# Altium schematic sheet sokolov_control_board_3.SchDoc: =title_line_1 + title_line_2
size 594 x 420 mm; SheetNumber: 3
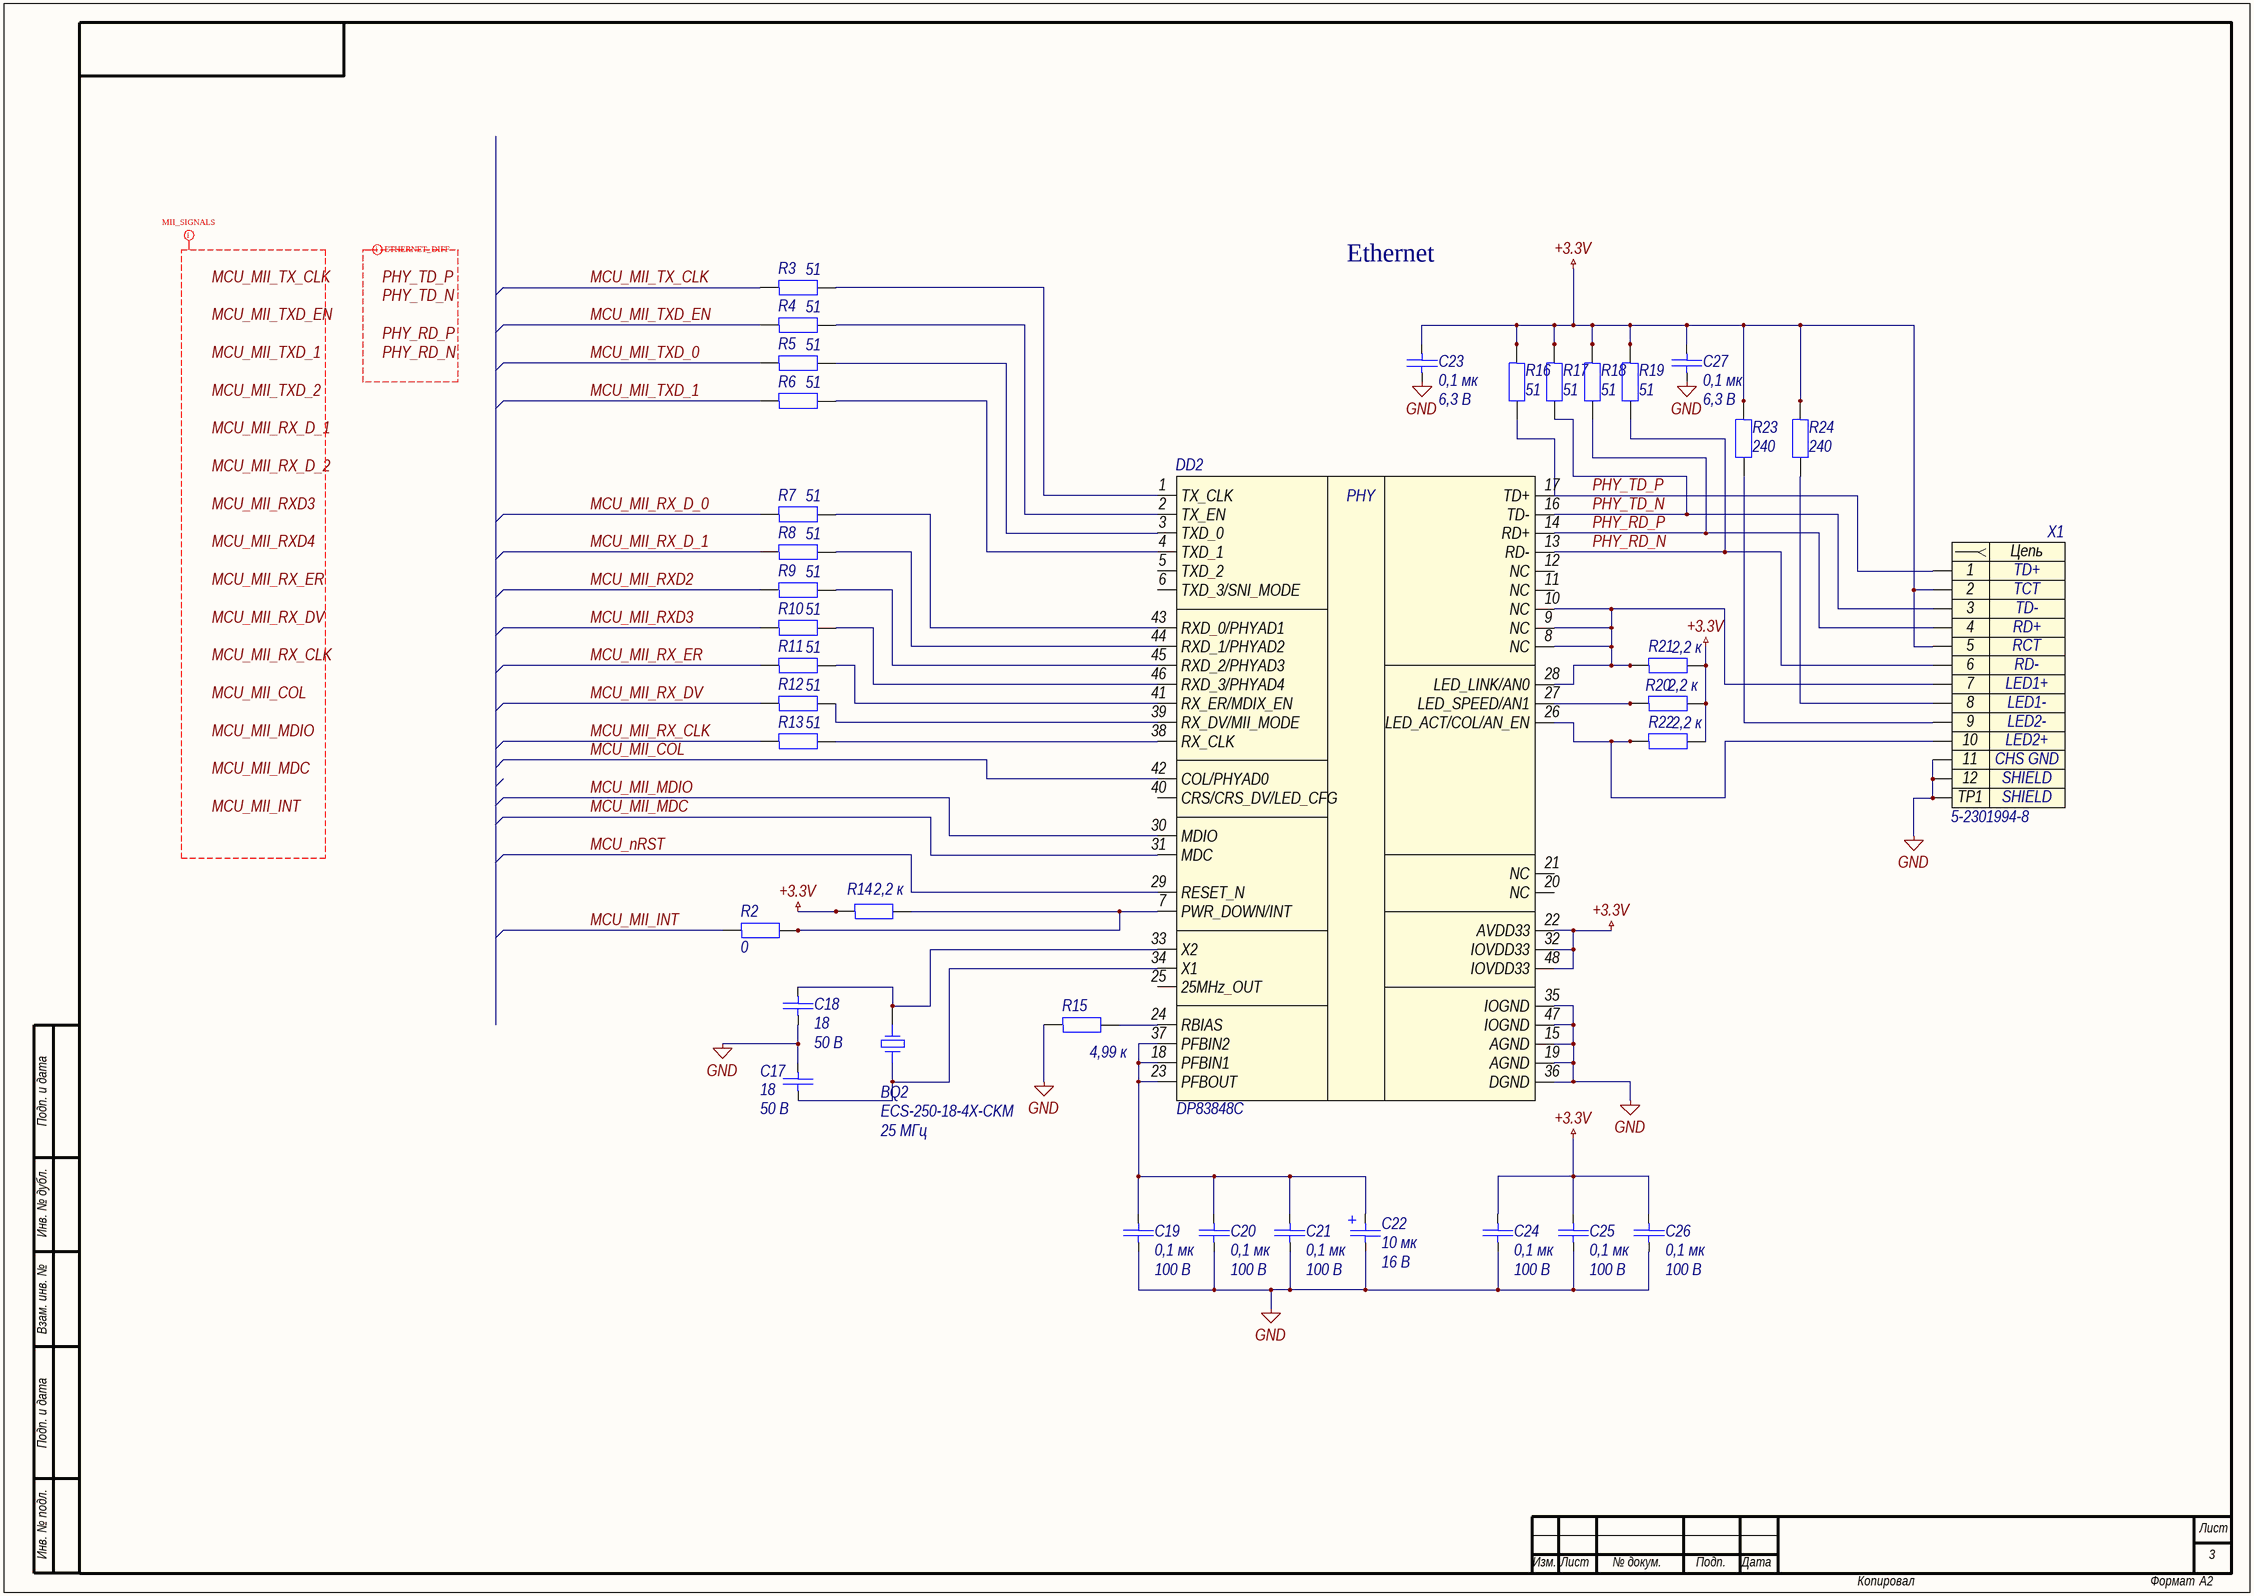
[diagram p0: sokolov_control_board_3.SchDoc]

## Parts
BQ2  ECS-250-18-4X-CKM  Частотa: 25 МГц  [HC-49/US]
C17  18  Напряжение: 50 В  [C0603]
C18  18  Напряжение: 50 В  [C0603]
C19  0,1 мк  Напряжение: 100 В  [C0603]
C20  0,1 мк  Напряжение: 100 В  [C0603]
C21  0,1 мк  Напряжение: 100 В  [C0603]
C22  10 мк  Напряжение: 16 В  [C3216-18]
C23  0,1 мк  Напряжение: 6,3 В  [C0402]
C24  0,1 мк  Напряжение: 100 В  [C0603]
C25  0,1 мк  Напряжение: 100 В  [C0603]
C26  0,1 мк  Напряжение: 100 В  [C0603]
C27  0,1 мк  Напряжение: 6,3 В  [C0402]
DD2  DP83848C  [LQFP-48-P50-700X700X160-L60X22]
R2  0  [R0603]
R3  51  [R0603]
R4  51  [R0603]
R5  51  [R0603]
R6  51  [R0603]
R7  51  [R0603]
R8  51  [R0603]
R9  51  [R0603]
R10  51  [R0603]
R11  51  [R0603]
R12  51  [R0603]
R13  51  [R0603]
R14  2,2 к  [R0603]
R15  4,99 к  [R0603]
R16  51  [R0603]
R17  51  [R0603]
R18  51  [R0603]
R19  51  [R0603]
R20  2,2 к  [R0603]
R21  2,2 к  [R0603]
R22  2,2 к  [R0603]
R23  240  [R0603]
R24  240  [R0603]
X1  5-2301994-8  [5-2301994-8]

## Nets
+3.3V: C23.2 C24.2 C25.2 C26.2 C27.2 DD2.22(AVDD33) DD2.32(IOVDD33) DD2.48(IOVDD33) R14.1 R16.1 R17.1 R18.1 R19.1 R20.2 R21.2 R22.2 R23.1 R24.1 X1.2 X1.5
GND: C17.2 C18.1 C19.1 C20.1 C21.1 C22.2 C23.1 C24.1 C25.1 C26.1 C27.1 DD2.15(AGND) DD2.19(AGND) DD2.35(IOGND) DD2.36(DGND) DD2.47(IOGND) R15.1 X1.11 X1.12 X1.TP1
MCU_MII_COL: DD2.42(COL/PHYAD0)
MCU_MII_INT: R2.1
MCU_MII_MDC: DD2.31(MDC)
MCU_MII_MDIO: DD2.30(MDIO)
MCU_MII_RX_CLK: R13.1
MCU_MII_RX_D_0: R7.1
MCU_MII_RX_D_1: R8.1
MCU_MII_RX_DV: R12.1
MCU_MII_RX_ER: R11.1
MCU_MII_RXD2: R9.1
MCU_MII_RXD3: R10.1
MCU_MII_TX_CLK: R3.1
MCU_MII_TXD_0: R5.1
MCU_MII_TXD_1: R6.1
MCU_MII_TXD_EN: R4.1
MCU_nRST: DD2.29(RESET_N)
PHY_RD_N: DD2.13(RD-) R19.2 X1.6
PHY_RD_P: DD2.14(RD+) R18.2 X1.4
PHY_TD_N: DD2.16(TD-) R17.2 X1.3
PHY_TD_P: DD2.17(TD+) R16.2 X1.1
NetBQ2_1: BQ2.1 C17.1 DD2.34(X1)
NetBQ2_2: BQ2.2 C18.2 DD2.33(X2)
NetC19_2: C19.2 C20.2 C21.2 C22.1 DD2.18(PFBIN1) DD2.23(PFBOUT) DD2.37(PFBIN2)
NetDD2_1: DD2.1(TX_CLK) R3.2
NetDD2_2: DD2.2(TX_EN) R4.2
NetDD2_3: DD2.3(TXD_0) R5.2
NetDD2_4: DD2.4(TXD_1) R6.2
NetDD2_7: DD2.7(PWR_DOWN/INT) R2.2 R14.2
NetDD2_8: DD2.8(NC) DD2.9(NC) DD2.10(NC) DD2.28(LED_LINK/AN0) R21.1 X1.7
NetDD2_24: DD2.24(RBIAS) R15.2
NetDD2_26: DD2.26(LED_ACT/COL/AN_EN) R22.1 X1.10
NetDD2_27: DD2.27(LED_SPEED/AN1) R20.1
NetDD2_38: DD2.38(RX_CLK) R13.2
NetDD2_39: DD2.39(RX_DV/MII_MODE) R12.2
NetDD2_41: DD2.41(RX_ER/MDIX_EN) R11.2
NetDD2_43: DD2.43(RXD_0/PHYAD1) R7.2
NetDD2_44: DD2.44(RXD_1/PHYAD2) R8.2
NetDD2_45: DD2.45(RXD_2/PHYAD3) R9.2
NetDD2_46: DD2.46(RXD_3/PHYAD4) R10.2
NetR23_2: R23.2 X1.9
NetR24_2: R24.2 X1.8

Not connected (* = marked no-connect by the designer): DD2 5(TXD_2) 6(TXD_3/SNI_MODE) 11(NC) 12(NC) 20(NC) 21(NC) 25(25MHz_OUT) 40(CRS/CRS_DV/LED_CFG)

## Layout directives
rule Width Constraint [Pref Impedance = 50,00ohms    Min Impedance = 50,00ohms    Max Impedance = 50,00ohms]; net class MII_CLASS: MCU_MII_COL, MCU_MII_INT, MCU_MII_MDC, MCU_MII_MDIO, MCU_MII_RX_CLK, MCU_MII_RX_D_1, MCU_MII_RX_D_2, MCU_MII_RX_DV, MCU_MII_RX_ER, MCU_MII_RXD3, MCU_MII_RXD4, MCU_MII_TX_CLK, MCU_MII_TXD_1, MCU_MII_TXD_2, MCU_MII_TXD_EN
differential pair; rule Differential Pairs Routing [Pref Gap = 0.254mm    Min Gap  = 0.15mm    Max Gap  = 0.254mmPref Width = 0.381mm    Min Width  = 0.155mm    Max Width  = 0.381mm]; differential pair class ETHERNET_DIFF_CLASS: PHY_RD_N, PHY_RD_P, PHY_TD_N, PHY_TD_P

## Notes on the sheet
- Ethernet
- Labels drawn without touching a wire or pin: MCU_MII_COL, MCU_MII_INT, MCU_MII_MDC, MCU_MII_MDIO, MCU_MII_RX_CLK, MCU_MII_RX_D_1, MCU_MII_RX_D_2, MCU_MII_RX_DV, MCU_MII_RX_ER, MCU_MII_RXD3, MCU_MII_RXD4, MCU_MII_TX_CLK, MCU_MII_TXD_1, MCU_MII_TXD_2, MCU_MII_TXD_EN, PHY_RD_N, PHY_RD_P, PHY_TD_N, PHY_TD_P
- Подп. и дата
- Инв. № дубл.
- Взам. инв. №
- Инв. № подл.
- Лист
- Изм.
- № докум.
- Подп.
- Дата
- Копировал
- Формат
- А2
- (in symbol dd0005) PHY
- (in symbol x0015) Цепь

## Library data of the parts
BQ2 = bq0007: =Описание; ID: bq0007; Фамилия: Соколов; Описание: Кварцевый резонатор 25 МГц нагрузочные конденсаторы 18 пФ; Производитель: ECS, Inc. International; Корпус: HC-49/USX; Наименование: ECS-250-18-4X-CKM; Частота: 25 МГц; HelpURL: https://ru.mouser.com/datasheet/2/122/hc_49usx-791.pdf
C17 C18 = c0180: =Описание; ID: c0180; Фамилия: Соколов; Описание: Конденсатор керамический чип 0603 18 пФ 50 В ±1 %; Наименование: CC0603FRNPO9BN200; Производитель: YAGEO Corp.; Отклонение: ±1 %; Рабочие температуры: от –55 °С до +125 °С; Температурный коэффициент емкости: C0G; Корпус: 0603; Номинал: 18; Номинальное напряжение: 50 В; HelpURL: https://www.yageo.com/upload/media/product/productsearch/datasheet/mlcc/UPY-GP_NP0_16V-to-50V_18.pdf
C19-C21 C24-C26 = c0089: =Описание; ID: c0089; Фамилия: Ларионов; Описание: Конденсатор керамический чип 0603 100 нФ 100 В ±10 %; Наименование: CC0603KRX7R0BB104; Производитель: YAGEO Corp.; Отклонение: ±10 %; Рабочие температуры: от –55 °С до +125 °С; Температурный коэффициент емкости: X7R; Корпус: 0603; Номинал: 0,1 мк; Номинальное напряжение: 100 В; HelpURL: https://www.yageo.com/upload/media/product/productsearch/datasheet/mlcc/UPY-NP0X7R_MV_100-to-630V_22.pdf
C22 = c0074: =Описание; ID: c0074; Фамилия: Паньков; Описание: Конденсатор танталовый чип 3216-18 10 мкФ 16 В ±10 %; Наименование: 293D106X9016A2TE3; Производитель: Vishay Intertechnology, Inc.; Отклонение: ±10 %; Эквивалентное последовательное сопротивление: 3,0 Ом; Среднеквадратичный размах пульсации тока: 0,16 А; Рабочие температуры: от –55 °С до +125 °С; Корпус: 3216-18; Номинал: 10 мк; Номинальное напряжение: 16 В; HelpURL: https://www.vishay.com/capacitors/list/product-40002/
C23 C27 = c0078: =Описание; ID: c0078; Фамилия: Паньков; Описание: Конденсатор керамический чип 0402 100 нФ 6,3 В ±10 %; Наименование: CC0402KRX5R5BB104; Производитель: YAGEO Corp.; Отклонение: ±10 %; Рабочие температуры: от –55 °С до +85 °С; Температурный коэффициент емкости: X5R; Корпус: 0402; Номинал: 0,1 мк; Номинальное напряжение: 6,3 В; HelpURL: https://www.yageo.com/upload/media/product/productsearch/datasheet/mlcc/UPY-GPHC_X5R_4V-to-50V_26.pdf
DD2 = dd0005: =Описание; Manufacturer: NationalSemiconductor; PackageTopMarking: NSUZXYTTDP83848VVVBC; PowerWise: N; CompType: InterfaceIC; ComponentLink1DescBC: DP83848CDatasheet; ComponentLink2DescA4: DP83848CWebPage; ComponentLink3DescAC: VBH48APackagePage; ID: dd0005; Фамилия: Соколов; Описание: Приемопередатчик Ethernet PHY 10/100 Мбит / с с интерфейсом SNI и поддержкой JTAG; Производитель: TI; Корпус: LQFP-48; Copyright: Copyright (C) 2018 Accelerated Designs. All rights reserved; Published: 4-Dec-2008; DatasheetVersion: May-2008; PackageVersion: revEMay-2007; PackageReference: VBH48A; Publisher: AltiumLimited; PackageDescription: LQFP7x7x14mm48Lead05mmPitch; SUPPLIER_3: 1Farnell; SUPPLIER_2: PartNumb0C1286816; SUPPLIER_4: 2Farnell; Supplier: PartNumb0F1528379; PartNumber: DP83848CVV; RoHS: Y; PinCount: 48; ComponentLink1URL: http//wwwnationalcom/ds/DP/DP83848Cpdf; ComponentLink2URL: http//wwwnationalcom/pf/DP/DP83848Chtml; ComponentLink3URL: http//wwwnationalcom/packaging/folders/vbh48ahtml; Наименование: DP83848C; HelpURL: https://www.ti.com/lit/gpn/dp83848c
R2 = r0001: =Описание; ID: r0001; Фамилия: Соколов; Описание: Резистор чип 0603 0 Ом ±1 % 0,1 Вт; Наименование: RC0603FR-130RL; Производитель: YAGEO Corp.; Отклонение: ±1 %; Номинальное напряжение: 75 В; Номинальный ток: 1 А; Рабочие температуры: от –55 °С до +155 °С; Корпус: 0603; Номинал: 0; HelpURL: https://www.yageo.com/upload/media/product/productsearch/datasheet/rchip/PYu-RC_Group_51_RoHS_L_11.pdf
R3-R13 R16-R19 = r0044: =Описание; ID: r0044; Фамилия: Паньков; Описание: Резистор чип 0603 51 Ом ±1 % 0,1 Вт; Наименование: RC0603FR-0751RL; Производитель: YAGEO Corp.; Отклонение: ±1 %; Номинальное напряжение: 75 В; Номинальный ток: 1 А; Рабочие температуры: от –55 °С до +155 °С; Корпус: 0603; Примечание: Ряд E24; Номинал: 51; HelpURL: https://www.yageo.com/upload/media/product/productsearch/datasheet/rchip/PYu-RC_Group_51_RoHS_L_11.pdf
R14 R20-R22 = r0085: =Описание; ID: r0085; Фамилия: Паньков; Описание: Резистор чип 0603 2,2 кОм ±1 % 0,1 Вт; Наименование: RC0603FR-072K2L; Производитель: YAGEO Corp.; Отклонение: ±1 %; Номинальное напряжение: 75 В; Номинальный ток: 1 А; Рабочие температуры: от –55 °С до +155 °С; Корпус: 0603; Примечание: Ряд E24; Номинал: 2,2 к; HelpURL: https://www.yageo.com/upload/media/product/productsearch/datasheet/rchip/PYu-RC_Group_51_RoHS_L_11.pdf
R15 = r0095: =Описание; ID: r0095; Фамилия: Жернаков; Описание: Резистор чип 0603 4,99 кОм ±1 % 0,1 Вт; Наименование: RC0603FR-074K99L; Производитель: YAGEO Corp.; Отклонение: ±1 %; Номинальное напряжение: 75 В; Номинальный ток: 1 А; Рабочие температуры: от –55 °С до +155 °С; Корпус: 0603; Номинал: 4,99 к; HelpURL: https://www.yageo.com/upload/media/product/productsearch/datasheet/rchip/PYu-RC_Group_51_RoHS_L_11.pdf
R23 R24 = r0061: =Описание; ID: r0061; Фамилия: Паньков; Описание: Резистор чип 0603 240 Ом ±1 % 0,1 Вт; Наименование: RC0603FR-07240RL; Производитель: YAGEO Corp.; Отклонение: ±1 %; Номинальное напряжение: 75 В; Номинальный ток: 1 А; Рабочие температуры: от –55 °С до +155 °С; Корпус: 0603; Примечание: Ряд E24; Номинал: 240; HelpURL: https://www.yageo.com/upload/media/product/productsearch/datasheet/rchip/PYu-RC_Group_51_RoHS_L_11.pdf
X1 = x0015: =Описание; Contact_1: TD+; Contact_2: TCT; Contact_3: TD-; Contact_4: RD+; Contact_5: RCT; Contact_6: RD-; Contact_7: LED1+; Contact_8: LED1-; Contact_9: LED2-; Contact_10: LED2+; Contact_11: CHS GND; TP1: SHIELD; ID: x0015; Фамилия: Ларионов; Описание: RJ45 интегрированный трансформатор 10/100 Mbps LED гнездо угловой; Производитель: TE Connectivity; Contact_12: SHIELD; Наименование: 5-2301994-8; HelpURL: https://www.te.com/usa-en/product-5-2301994-8.html